# Altium schematic sheet [04] - REVISION HISTORY.SchDoc
size Letter; Author: Daniel E. Mundo; DocumentNumber: 4; Revision: 1.0; SheetNumber: 4; SheetTotal: 5
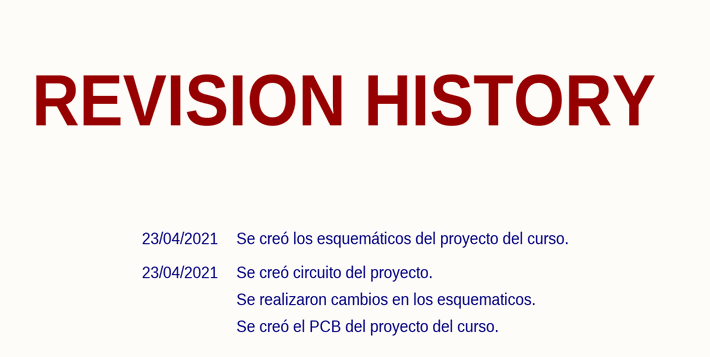
[diagram p0: [04] - REVISION HISTORY.SchDoc]

## Notes on the sheet
- REVISION HISTORY
- 23/04/2021
- Se creó los esquemáticos del proyecto del curso.
- Se creó circuito del proyecto.
- Se realizaron cambios en los esquematicos.
- Se creó el PCB del proyecto del curso.
- Project:
- Page content:
- Revision:
- Size:
- Letter
- Design:
- Document Number:
- Date:
- Sheet:
- of